# Altium project KASHIFPART2.PrjPcb
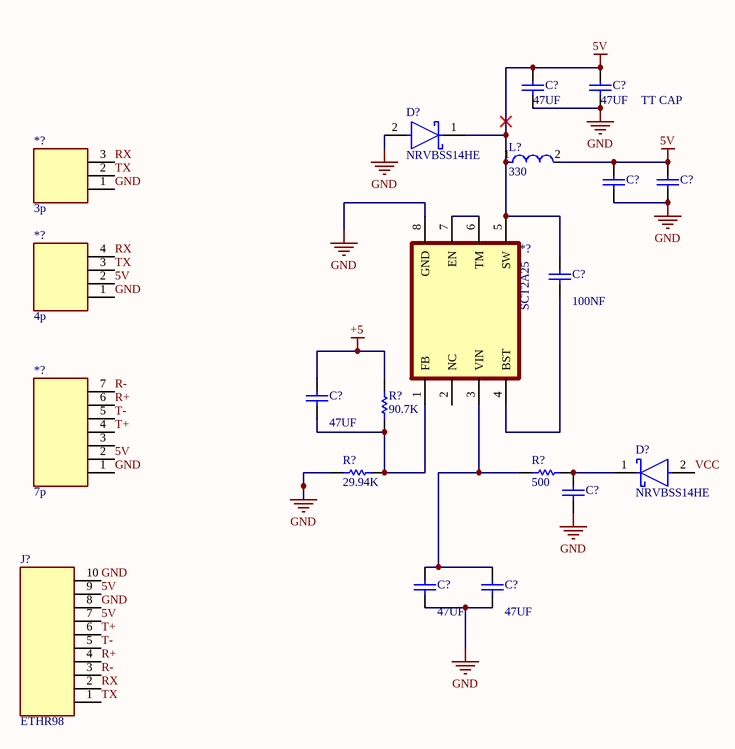
[diagram p0: Sheet1.SchDoc]
1 sheet, 20 parts. Net scope: global (net labels, ports and power ports of the same name join across sheets).

## Sheet Sheet1.SchDoc
size A; SheetNumber: 1; SheetTotal: 1

### Parts
(Parts that share a designator on the sheet are numbered #1, #2 ... from top to bottom, then left to right.)
*?#1  3p
*?#2  4p
*?#3  SCT2A25
*?#4  7p
C?#1  47UF  [CAPC1005X56X25LL10T15]
C?#2  47UF  [CAPC1005X56X25LL10T15]
C?#3  (no value)  [CAPC1005X56X25LL10T15]
C?#4  (no value)  [CAPC1005X56X25LL10T15]
C?#5  100NF  [CAPC1005X56X25LL10T15]
C?#6  47UF  [CAPC1005X56X25LL10T15]
C?#7  (no value)  [CAPC1005X56X25LL10T15]
C?#8  47UF  [CAPC1005X56X25LL10T15]
C?#9  47UF  [CAPC1005X56X25LL10T15]
D?#1  NRVBSS14HE  [FP-477AD-MFG]
D?#2  NRVBSS14HE  [FP-477AD-MFG]
J?  ETHR98
L?  330  [FP-LQH31CN_03-MFG]
R?#1  90.7K  [RESC1005X40X25LL05T10]
R?#2  29.94K  [RESC1005X40X25LL05T10]
R?#3  500  [RESC1005X40X25LL05T10]

### Nets
5V: *?#2.2(RX) *?#3.5(SW) *?#4.2(RX) C?#1.2 C?#2.2 C?#3.2 C?#4.2 C?#5.2 D?#1.1(C) J?.7(5V) J?.9(5V) L?.1 L?.2
+5: C?#6.2 R?#1.2
GND: *?#1.1(TX) *?#2.1(TX) *?#3.8(GND) *?#4.1(TX) C?#1.1 C?#2.1 C?#3.1 C?#4.1 C?#7.1 C?#8.1 C?#9.1 D?#1.2(A) J?.8(G) J?.10(G) R?#2.2
R+: *?#4.6(T+) J?.4(R+)
R-: *?#4.7(5V) J?.3(R-)
RX: *?#1.3(R-) *?#2.4(R+) J?.2(RX)
T+: *?#4.4(R+) J?.6(T+)
T-: *?#4.5(T-) J?.5(T-)
TX: *?#1.2(RX) *?#2.3(R-) J?.1(TX)
VCC: D?#2.2(A)
Net*?#3_1: *?#3.1(FB) C?#6.1 R?#1.1 R?#2.1
Net*?#3_3: *?#3.3(VIN) C?#8.2 C?#9.2 R?#3.2
Net*?#3_4: *?#3.4(BST) C?#5.1
Net*?#3_6: *?#3.6(TM) *?#3.7(EN)
NetC?#7_2: C?#7.2 D?#2.1(C) R?#3.1

Not connected (* = marked no-connect by the designer): *?#3 2(NC); *?#4 3(R-)

### Notes on the sheet
- (near C?#2) TT CAP

### Library data of the parts
C?#1-C?#9 = CMP-2008-02962-1
  C?#1 C?#2 C?#6 C?#8 C?#9: VALUE: 47UF
  C?#5: VALUE: 100NF
D?#1 D?#2 = CMP-00278-93203856-2: NRVBSS14HE Rectifier Diode, Schottky, 1 Phase, 1 Element, 1A, 40V V(RRM), Silicon; Manufacturer Lifecycle Status: ACTIVE; Capacitance: 55pF; Max Forward Surge Current (Ifsm): 25A; Peak Reverse Current: 5µA; Max Junction Temperature (Tj): 150°C; Forward Current: 1A; Min Operating Temperature: -55°C; NexarPartId: 93203856; Reverse Voltage: 40V; Max Operating Temperature: 150°C; RoHS: Compliant; Lifecycle Status: Production; Max Repetitive Reverse Voltage (Vrrm): 40V; Height: 750µm
L? = CMP-06042-002477-1: Inductance: 330
R?#1-R?#3 = CMP-2002-07161-1
  R?#1: VALUE: 90.7K
  R?#2: VALUE: 29.94K
  R?#3: VALUE: 500